# Altium schematic sheet Schmatic_ReallyARobot_AD PIR Module V1.0.SchDoc
size A4
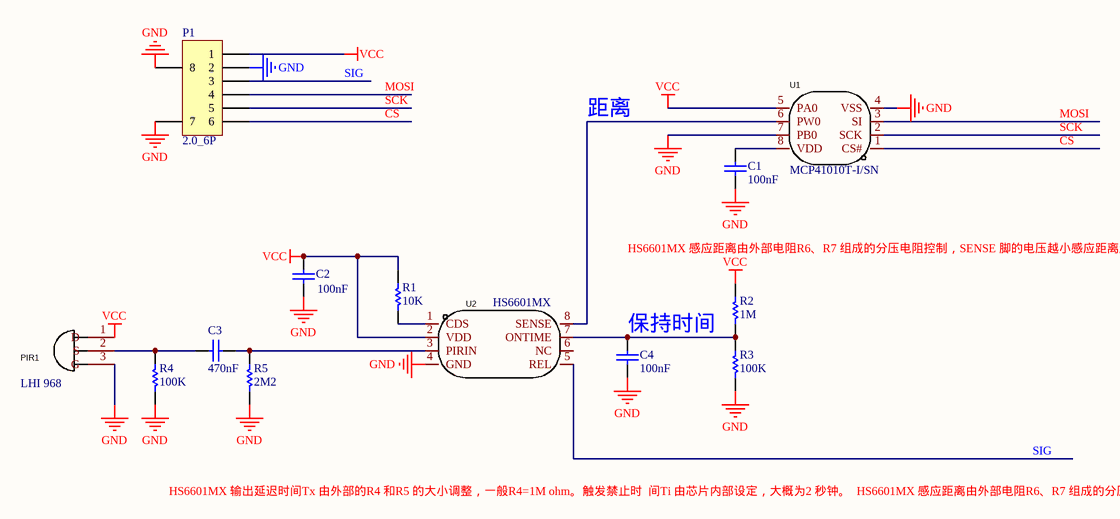
[diagram p0: Schmatic_ReallyARobot_AD PIR Module V1.0.SchDoc]

## Parts
C1  100nF  [0805C]
C2  100nF  [0603C]
C3  470nF  [0603C]
C4  100nF  [0805C]
P1  2.0_6P  [HDR1X6]
PIR1  LHI 968  [TO-5-3_L8.2-W8.2]
R1  10K  [0805R]
R2  1M  [0805R]
R3  100K  [0805R]
R4  100K  [0805R]
R5  2M2  [0805R]
U1  MCP41010T-I/SN  [SO-8]
U2  HS6601MX  [SOP-8_L4.9-W3.9-P1.27-LS6.0-BL]

## Nets
GND: C1.1 C2.1 C4.1 P1.2 P1.7 P1.8 PIR1.3(G) R3.2 R4.2 R5.2 U1.4(VSS) U1.7(PB0) U2.4(GND)
VCC: C2.2 P1.1 PIR1.1(D) R1.1 R2.1 U1.5(PA0) U2.2(VDD)
CS: P1.6 U1.1(CS#)
MOSI: P1.4 U1.3(SI)
SCK: P1.5 U1.2(SCK)
SIG: P1.3 U2.5(REL)
NetC1_2: C1.2 U1.8(VDD)
NetC3_1: C3.1 R5.1 U2.3(PIRIN)
NetC3_2: C3.2 PIR1.2(S) R4.1
NetC4_2: C4.2 R2.2 R3.1 U2.7(ONTIME)
NetR1_2: R1.2 U2.1(CDS)
NetU1_6: U1.6(PW0) U2.8(SENSE)

Not connected (* = marked no-connect by the designer): U2 6(NC)

## Notes on the sheet
- 距离
- (near C4) 保持时间
- Labels drawn without touching a wire or pin: HS6601MX 感应距离由外部电阻R6、R7 组成的分压电阻控制，SENSE 脚的电压越小感应距离越  远, HS6601MX 输出延迟时间Tx 由外部的R4 和R5 的大小调整，一般R4=1M ohm。触发禁止时  间Ti 由芯片内部设定，大概为2 秒钟。  HS6601MX 感应距离由外部电阻R6、R7 组成的分压

## Library data of the parts
C1-C4 = Cap: Capacitor; Published: 8-Jun-2000; LatestRevisionDate: 17-Jul-2002; LatestRevisionNote: Re-released for DXP Platform.; Publisher: Altium Limited
  C1 C4: PackageReference: RAD-0.2
  C2 C3: PackageReference: RAD-0.3; PackageDescription: Radial Cap, Thru-Hole; 2 Leads; 0.3 in Pin Spacing
P1 = Header 6: Header, 6-Pin; LatestRevisionDate: 17-Jul-2002; LatestRevisionNote: Re-released for DXP Platform.; Publisher: Altium Limited
PIR1 = D203S: Add into BOM: yes; Symbol: D203S; Device: D203S; Supplier Part: C78793; Manufacturer Part: D203S; Supplier Footprint: TO-5-3; JLCPCB Part Class: Extended Part; Datasheet: https://atta.szlcsc.com/upload/public/pdf/source/20170311/1489211337855.pdf; Supplier: LCSC; Convert to PCB: yes
R1-R5 = Res1: Resistor; Published: 8-Jun-2000; Revision: July-2002: Re-released for DXP Platform.; Publisher: Altium Limited
U1 = MCP41010T-I/SN: Add into BOM: yes; Name: MCP41010T-I/SN; Symbol: MCP41010T-I/SN; Device: MCP41010T-I/SN; LCSC Part Name: MCP41010T-I/SN; Supplier Part: C136395; Manufacturer Part: MCP41010T-I/SN; Supplier Footprint: SOIC-8; JLCPCB Part Class: Extended Part; Datasheet: https://atta.szlcsc.com/upload/public/pdf/source/20171018/C136395_15083234906061043046.pdf; Supplier: LCSC; Convert to PCB: yes; Resistance Value (Ohms): -; Temperature Coefficient (Typ): -; Precision: -; Interface Type: -
U2 = HS6601MX: Add into BOM: yes; Symbol: HS6601MX; Device: HS6601MX; LCSC Part Name: HS6601MX; Supplier Part: C5142023; Manufacturer Part: HS6601MX; Supplier Footprint: SOP-8; JLCPCB Part Class: Extended Part; Datasheet: https://atta.szlcsc.com/upload/public/pdf/source/20220923/7B404CBF8030A6A4AB9CFA64713E35CC.pdf; Supplier: LCSC; Convert to PCB: yes